# Altium project PROC054D_MMW_CAS_RF_EVM.PrjPcb (part 3 of 9)

## Sheet PROC054D_FMCW_Sync.SchDoc: FMCW_SYNC
size 558 x 431 mm; Date: Not shown in title block; ApprovedBy: Not shown in title block; CheckedBy: Not shown in title block; Author: Not shown in title block; CompanyName: Not shown in title block; DrawnBy: a0271760; Engineer: Not shown in title block; Organization: Not shown in title block; Address1: Not shown in title block; Address2: Not shown in title block; Address3: Not shown in title block; Address4: Not shown in title block; DocumentNumber: 14; Revision: Use project pAWRameter SCH_Rev; SheetNumber: 14; SheetTotal: 19; PageSetup: Record=PageOptions|CenterHorizontal=True|CenterVertical=True|PrintScale=1.00|XCorrection=1.00|YCorrection=1.00|PrintKind=0|BorderSize=5000000|LeftOffset=0|BottomOffset=0|Orientation=2|PaperLength=1000|PaperWidth=1000|Scale=100|PaperSource=15|PrintQuality=600|MediaType=1|DitherType=10|PaperKind=Letter|PrintScaleMode=1; CurrentTime: Not shown in title block; CurrentDate: Not shown in title block; Time: Not shown in title block; DocumentFullPathAndName: Not shown in title block; DocumentName: Not shown in title block; ModifiedDate: Not shown in title block; ImagePath: Not shown in title block
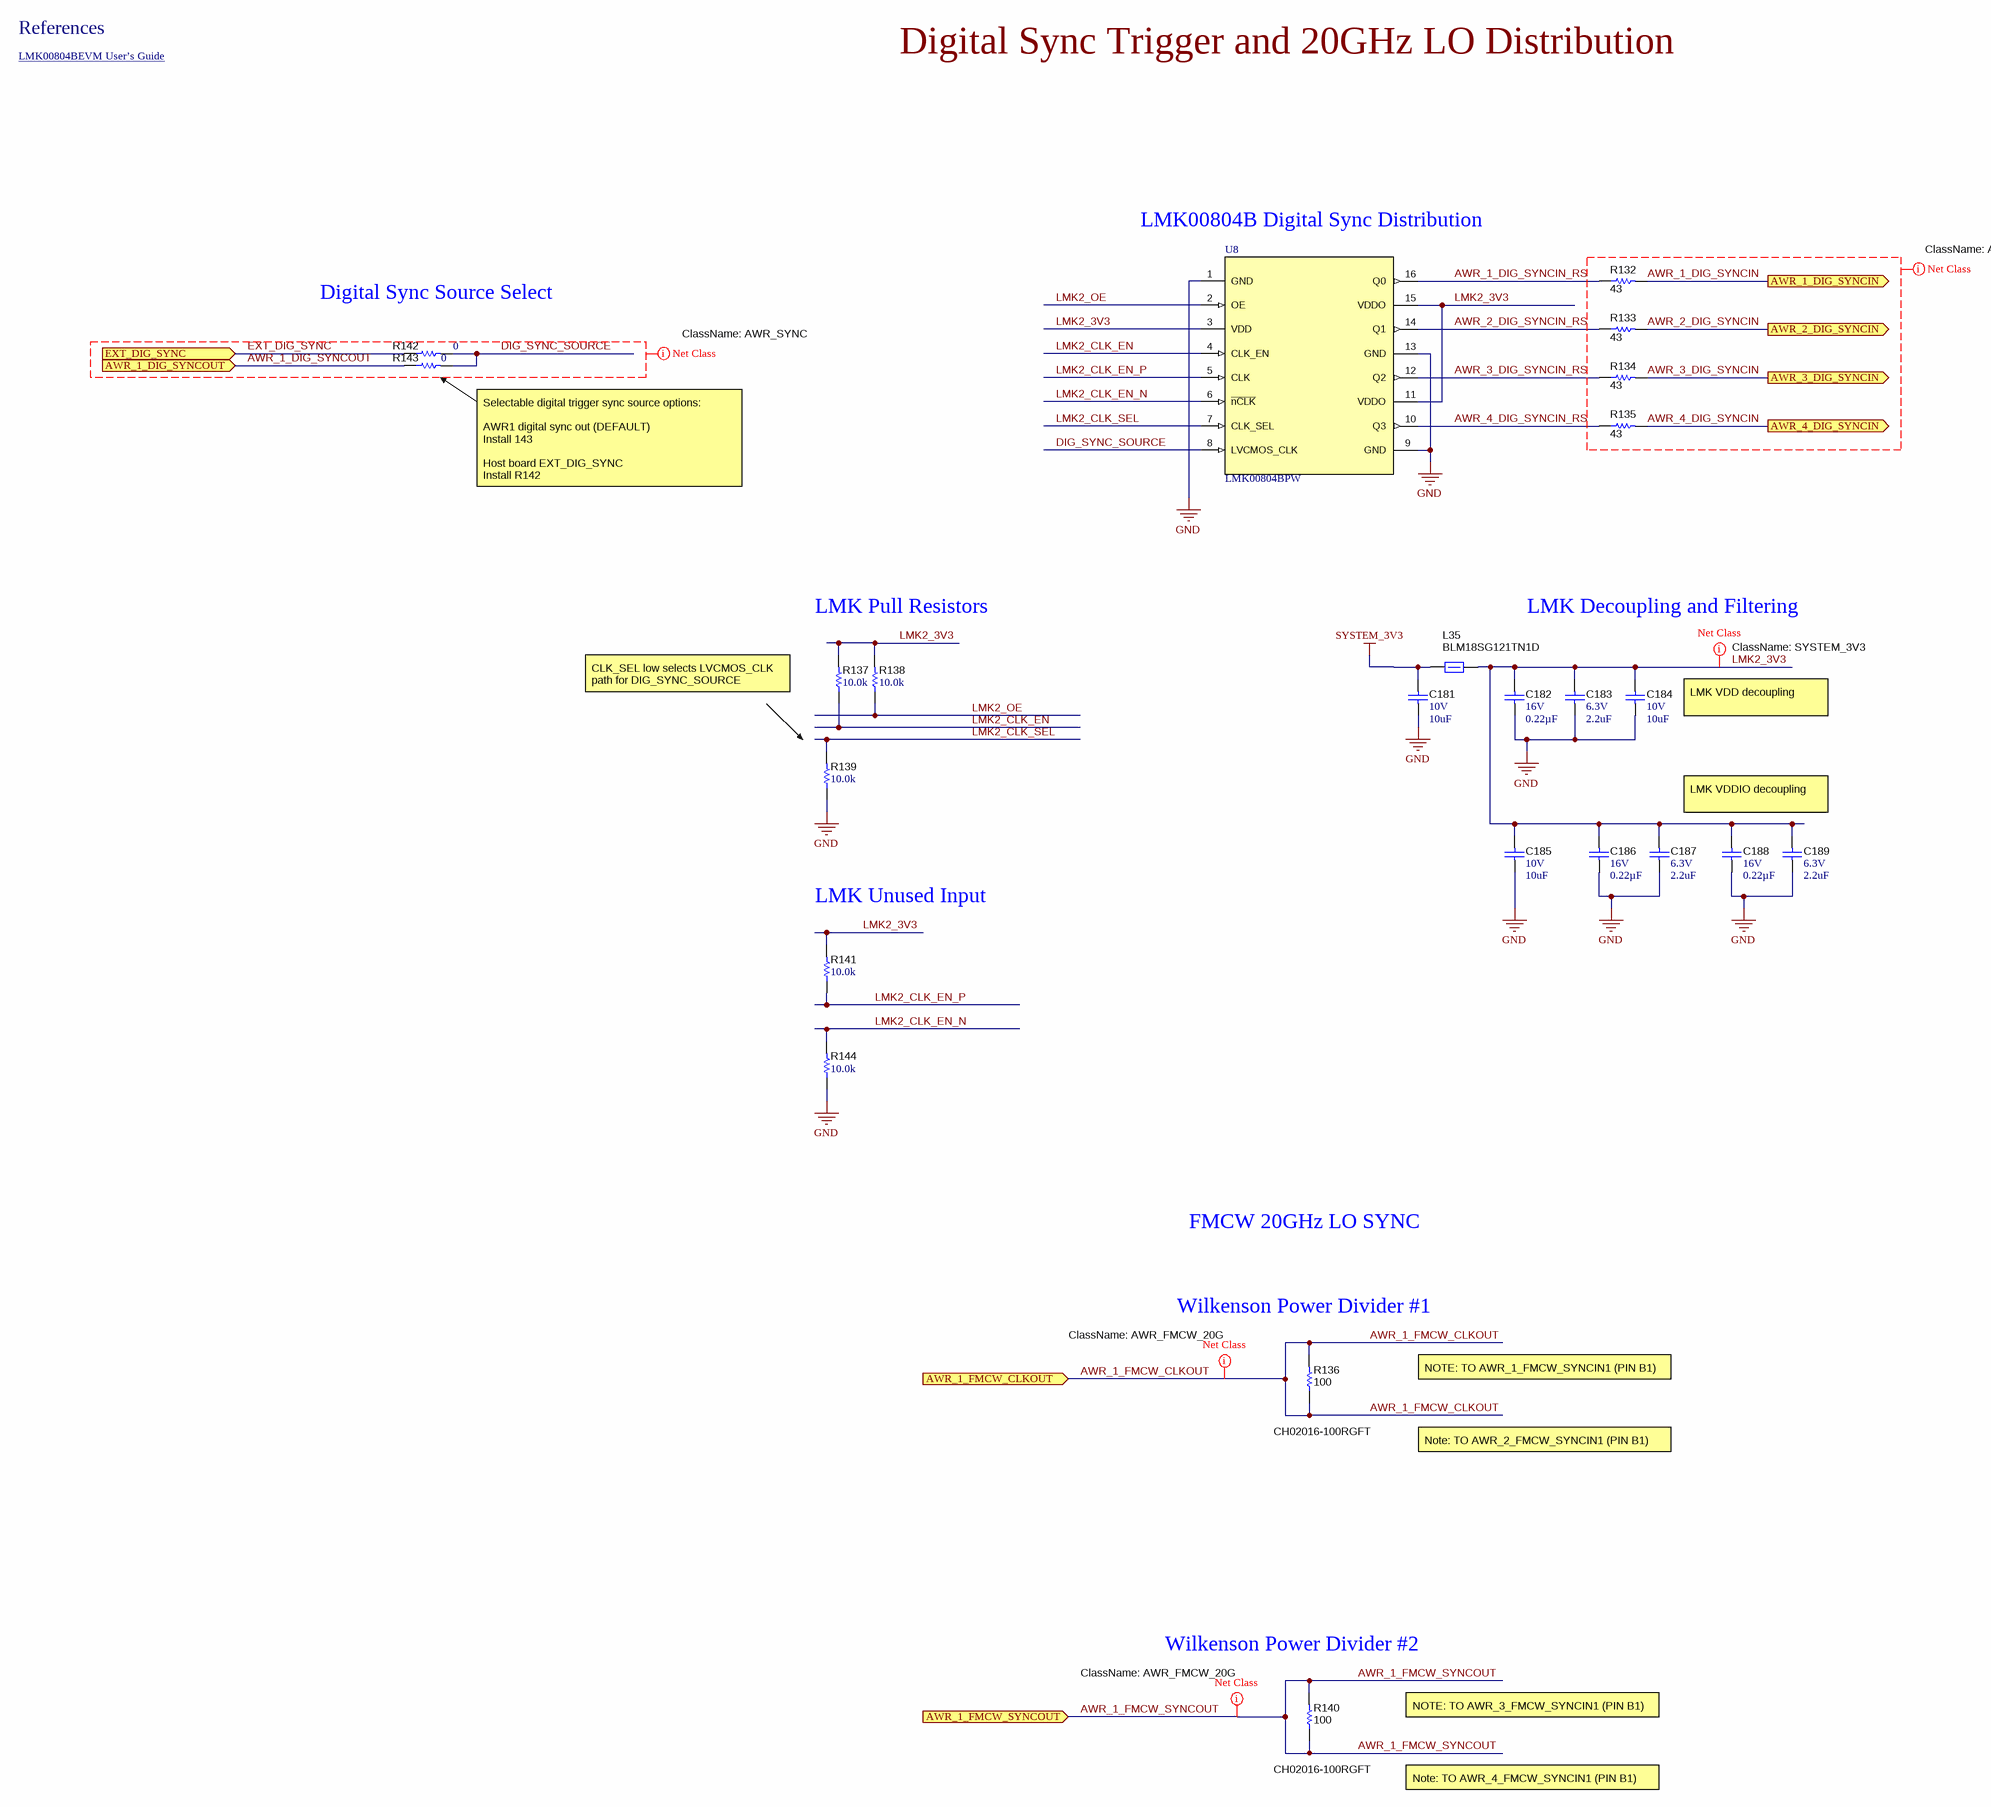
[diagram p10: PROC054D_FMCW_Sync.SchDoc]

### Parts
C181  VDC_V: 10V  ValueDisplayed: 10uF  [0805_HV]  (hidden comment: GCM21BR71A106KE22L)
C182  VDC_V: 16V  ValueDisplayed: 0.22µF  [0402]  (hidden comment: GCM155R71C224KE02D)
C183  VDC_V: 6.3V  ValueDisplayed: 2.2uF  [0603]  (hidden comment: GCM188R70J225KE22D)
C184  VDC_V: 10V  ValueDisplayed: 10uF  [0805_HV]  (hidden comment: GCM21BR71A106KE22L)
C185  VDC_V: 10V  ValueDisplayed: 10uF  [0805_HV]  (hidden comment: GCM21BR71A106KE22L)
C186  VDC_V: 16V  ValueDisplayed: 0.22µF  [0402]  (hidden comment: GCM155R71C224KE02D)
C187  VDC_V: 6.3V  ValueDisplayed: 2.2uF  [0603]  (hidden comment: GCM188R70J225KE22D)
C188  VDC_V: 16V  ValueDisplayed: 0.22µF  [0402]  (hidden comment: GCM155R71C224KE02D)
C189  VDC_V: 6.3V  ValueDisplayed: 2.2uF  [0603]  (hidden comment: GCM188R70J225KE22D)
L35  BLM18SG121TN1D  [0603]
R132  ValueDisplayed: 43  [0402]  (hidden comment: CRCW040243R0JNED)
R133  ValueDisplayed: 43  [0402]  (hidden comment: CRCW040243R0JNED)
R134  ValueDisplayed: 43  [0402]  (hidden comment: CRCW040243R0JNED)
R135  ValueDisplayed: 43  [0402]  (hidden comment: CRCW040243R0JNED)
R136  ValueDisplayed: 100  [02016]  (hidden comment: CH02016-100RGFT)
R137  ValueDisplayed: 10.0k  [0402]  (hidden comment: CRCW040210K0FKED)
R138  ValueDisplayed: 10.0k  [0402]  (hidden comment: CRCW040210K0FKED)
R139  ValueDisplayed: 10.0k  [0402]  (hidden comment: CRCW040210K0FKED)
R140  ValueDisplayed: 100  [02016]  (hidden comment: CH02016-100RGFT)
R141  ValueDisplayed: 10.0k  [0402]  (hidden comment: CRCW040210K0FKED)
R142  ValueDisplayed: 0  [0402]  (hidden comment: ERJ-2GE0R00X)
R143  ValueDisplayed: 0  [0402]  (hidden comment: ERJ-2GE0R00X)
R144  ValueDisplayed: 10.0k  [0402]  (hidden comment: CRCW040210K0FKED)
U8  LMK00804BPW  [PW0016A_N]

### Ports
AWR_1_DIG_SYNCIN (out), AWR_1_DIG_SYNCOUT (in), AWR_1_FMCW_CLKOUT (in), AWR_1_FMCW_SYNCOUT (in), AWR_2_DIG_SYNCIN (out), AWR_3_DIG_SYNCIN (out), AWR_4_DIG_SYNCIN (out), EXT_DIG_SYNC (in)

### Nets
GND: C181.2 C182.2 C183.1 C184.2 C185.2 C186.2 C187.1 C188.2 C189.1 R139.1 R144.1 U8.1(GND) U8.9(GND) U8.13(GND)
SYSTEM_3V3: C181.1 L35.1
AWR_1_DIG_SYNCIN: R132.2 ; port AWR_1_DIG_SYNCIN
AWR_1_DIG_SYNCIN_RS: R132.1 U8.16(Q0)
AWR_1_DIG_SYNCOUT: R143.1 ; port AWR_1_DIG_SYNCOUT
AWR_1_FMCW_CLKOUT: R136.1 R136.2 ; port AWR_1_FMCW_CLKOUT
AWR_1_FMCW_SYNCOUT: R140.1 R140.2 ; port AWR_1_FMCW_SYNCOUT
AWR_2_DIG_SYNCIN: R133.2 ; port AWR_2_DIG_SYNCIN
AWR_2_DIG_SYNCIN_RS: R133.1 U8.14(Q1)
AWR_3_DIG_SYNCIN: R134.2 ; port AWR_3_DIG_SYNCIN
AWR_3_DIG_SYNCIN_RS: R134.1 U8.12(Q2)
AWR_4_DIG_SYNCIN: R135.2 ; port AWR_4_DIG_SYNCIN
AWR_4_DIG_SYNCIN_RS: R135.1 U8.10(Q3)
DIG_SYNC_SOURCE: R142.2 R143.2 U8.8(LVCMOS_CLK)
EXT_DIG_SYNC: R142.1 ; port EXT_DIG_SYNC
LMK2_3V3: C182.1 C183.2 C184.1 C185.1 C186.1 C187.2 C188.1 C189.2 L35.2 R137.2 R138.2 R141.2 U8.3(VDD) U8.11(VDDO) U8.15(VDDO)
LMK2_CLK_EN: R137.1 U8.4(CLK_EN)
LMK2_CLK_EN_N: R144.2 U8.6(~{nCLK})
LMK2_CLK_EN_P: R141.1 U8.5(CLK)
LMK2_CLK_SEL: R139.2 U8.7(CLK_SEL)
LMK2_OE: R138.1 U8.2(OE)

### Layout directives
net class SYSTEM_3V3: LMK2_3V3
net class AWR_FMCW_20G: AWR_1_FMCW_CLKOUT, AWR_1_FMCW_SYNCOUT
net class AWR_SYNC: AWR_1_DIG_SYNCIN, AWR_1_DIG_SYNCOUT, AWR_2_DIG_SYNCIN, AWR_3_DIG_SYNCIN, AWR_4_DIG_SYNCIN, DIG_SYNC_SOURCE, EXT_DIG_SYNC

### Notes on the sheet
- References
- LMK00804BEVM User’s Guide <http://www.ti.com/lit/ug/snou129/snou129.pdf>
- Digital Sync Trigger and 20GHz LO Distribution
- LMK00804B Digital Sync Distribution
- Digital Sync Source Select
- Selectable digital trigger sync source options:
  AWR1 digital sync out (DEFAULT)
  Install 143
  Host board EXT_DIG_SYNC
  Install R142
- LMK Pull Resistors
- LMK Decoupling and Filtering
- CLK_SEL low selects LVCMOS_CLK path for DIG_SYNC_SOURCE
- LMK VDD decoupling
- LMK VDDIO decoupling
- LMK Unused Input
- FMCW 20GHz LO SYNC
- Wilkenson Power Divider #1
- NOTE: TO AWR_1_FMCW_SYNCIN1 (PIN B1)
- Note: TO AWR_2_FMCW_SYNCIN1 (PIN B1)
- Wilkenson Power Divider #2
- NOTE: TO AWR_3_FMCW_SYNCIN1 (PIN B1)
- Note: TO AWR_4_FMCW_SYNCIN1 (PIN B1)
- Drawn By:
- SVN Rev:
- Number:
- TID #:
- Orderable:
- Rev:
- Sheet Title:
- File:
- Project Title:
- Designed for:
- Assembly VAWRiant:
- Mod. Date:
- Sheet:
- Size:
- of
- C
- http://www.ti.com
- Texas Instruments and/or its licensors do not wAWRrant the accuracy or completeness of this specification or any information contained therein. Texas Instruments and/or its licensors do not wAWRrant that this design will meet the specifications, will be suitable for your application or fit for any pAWRticulAWR purpose, or will operate in an implementation. Texas Instruments and/or its licensors do not wAWRrant that the design is production worthy. You should completely validate and test your design implementation to confirm the system functionality for your application.
- Engineer:
- Contact:
- © Texas Instruments

### Library data of the parts
C181 C184 C185 = CMP-0008017-2: CAP, CERM, 10 uF, 10 V, +/- 10%, X7R, 0805; Manufacturer: MuRata; TaMin_C: -55°C; Polarized: N; SizeAreaWB_mm2: 6.75; Value1: Unknown; U/M: EA; Value: 10uF; TaMax_C: 125°C; SizeZ_mm: 1.45; SizeX_mm: 2; SizeY_mm: 1.25; Cap_Case: 0805; SizeArea_mm2: 2.5; CompType: Capacitor; Cap_F: 10µF; AEC Category: Q200; Supplier Part Number 2: 06AC6014; Publisher: Texas Instruments; Supplier 2: Newark; Supplier Part Number 3: 81-GCM21BR71A106KE2L; TempCo: X7R; Supplier 3: Mouser; Published: 2008-06-19; RoHS: Y; MountType: SMT; Supplier 1: Digi-Key; PackageReference: 0805; Tolerance_%: 10%; Value2: 10V; LatestRevisionDate: 2017-03-09; PartNumber: GCM21BR71A106KE22L; AEC Qualified: ?; ComponentLink1Description: Datasheet link; Supplier Part Number 1: 490-10674-1-ND; Technology: Ceramic; ComponentLink1URL: http://www.murata.com/products/catalog/pdf/c03e.pdf
C182 C186 C188 = CMP-0078265-1: CAP, CERM, 0.22 µF, 16 V,+/- 10%, X7R, AEC-Q200 Grade 1, 0402; Manufacturer: MuRata; TaMin_C: -55°C; Polarized: N; SizeAreaWB_mm2: 3; U/M: EA; Value: 0.22uF; TaMax_C: 125°C; SizeZ_mm: 0.6; SizeX_mm: 1; SizeY_mm: 0.5; CompType: Capacitor; AEC Qualified: Y; Cap_F: 220nF; AEC Category: Q200; ComponentLink1URL: http://psearch.en.murata.com/capacitor/product/GCM155R71C224KE02%23.pdf; Supplier Part Number 2: 81-GCM155R71C224KE2D; Supplier 2: Mouser; TempCo: X7R; RoHS: Y; MountType: SMT; Supplier 1: Digi-Key; PackageReference: 0402; Tolerance_%: 10%; Cap_Case: 0402; Value2: 16V; SizeArea_mm2: 0.5; PartNumber: GCM155R71C224KE02D; ComponentLink1Description: Datasheet link; AEC Grade: 1; Supplier Part Number 1: 490-10671-1-ND; Technology: Ceramic
C183 C187 C189 = CMP-0007134-5: CAP, CERM, 2.2 uF, 6.3 V, +/- 10%, X7R, AEC-Q200 Grade 1, 0603; Manufacturer: MuRata; TaMin_C: -55°C; Polarized: N; SizeAreaWB_mm2: 4.68; Value1: Unknown; U/M: EA; Value: 2.2uF; TaMax_C: 125°C; SizeZ_mm: 1; SizeX_mm: 1.6; SizeY_mm: 0.8; SizeArea_mm2: 1.28; AEC Qualified: Y; Cap_F: 2.2µF; AEC Category: Q200; Supplier Part Number 2: 81-GCM188R70J225KE2D; Publisher: Texas Instruments; Supplier 2: Mouser; TempCo: X7R; Published: 2008-06-19; RoHS: Y; MountType: SMT; Supplier 1: Digi-Key; PackageReference: 0603; Tolerance_%: 10%; Cap_Case: 0603; Value2: 6.3V; CompType: Capacitor; LatestRevisionDate: 2017-03-09; PartNumber: GCM188R70J225KE22D; ComponentLink1Description: Datasheet link; AEC Grade: 1; Supplier Part Number 1: 490-5316-1-ND; Technology: Ceramic; ComponentLink1URL: http://psearch.en.murata.com/capacitor/product/GCM188R70J225KE22%23.pdf
L35 = CMP-0003352-2: Ferrite Bead, 120 ohm @ 100 MHz, 3 A, 0603; Manufacturer: MuRata; ZTyp@100MHz_Ohm: 120; SizeAreaWB_mm2: 4.68; DCR_ohm: 0.025; Value1: 0.025 ohm; Value: 120 ohm; Imax_A: 3A; SizeZ_mm: 1; SizeX_mm: 1.6; SizeY_mm: 0.8; SizeArea_mm2: 1.28; ComponentLink1URL: http://search.murata.co.jp/Ceramy/image/img/PDF/ENG/L0110S0100BLM18S.pdf; Supplier Part Number 2: 73M9122; Publisher: Texas Instruments; Supplier 2: Newark; Supplier Part Number 3: 81-BLM18SG121TN1D; Supplier 3: Mouser; Published: 2014-04-30; RoHS: Y; MountType: SMT; Supplier 1: Digi-Key; PackageReference: 0603; Value2: 3A; CompType: Ferrite Bead; LatestRevisionDate: 2017-03-09; PartNumber: BLM18SG121TN1D; ComponentLink1Description: Datasheet link; Supplier Part Number 1: 490-3996-1-ND; ValueDisplayed: 120 ohm
R132-R135 = CMP-0026932-3: RES, 43, 5%, 0.063 W, AEC-Q200 Grade 0, 0402; Manufacturer: Vishay-Dale; Power_W: 63mW; TempCo: 200 ppm/C; Value_Code: 43R0; Value: 43; EIA_Code: E24; SizeX_mm: 1; SizeY_mm: 0.5; SizeZ_mm: 0.6; Value2: 0.063W; AEC Qualified: Y; VDC_V: 50V; AEC Category: Q200; AEC Grade: 0; Supplier Part Number 2: 71-CRCW0402J-43-E3; Supplier 2: Mouser; RoHS: E; Value1: 5%; MountType: SMT; Supplier 1: Digi-Key; PackageReference: 0402; Tolerance_%: 5%; Res_ohm: 43; SizeArea_mm2: 0.5; CompType: Resistor; PartNumber: CRCW040243R0JNED; ComponentLink1Description: Datasheet link; Supplier Part Number 1: 541-43JCT-ND; Technology: Thick Film; ComponentLink1URL: http://www.vishay.com/docs/20035/dcrcwe3.pdf
R136 = CMP-0083872-1: RES, 100, 2%, 0.03 W, 02016; Manufacturer: Vishay-Semiconductor; Tolerance_%: 5%; Value_Code: 100R; SizeAreaWB_mm2: 2.0572; SizeArea_mm2: 0.1872; AEC Qualified: N; AEC Category: Q200; Value: 100; SizeZ_mm: 0.547; EIA_Code: E24; TempCo: 100 ppm/C; Power_W: 30mW; VDC_V: 30V; SizeY_mm: 0.39; Value2: 0.03W; SizeX_mm: 0.48; ComponentLink1Description: Datasheet link; RoHS: Y; PackageReference: 02016; Technology: Thin Film; Res_ohm: 100; PartNumber: CH02016-100RGFT; AEC Grade: N/A; ComponentLink1URL: http://www.vishay.com/docs/53014/ch.pdf; Value1: 2%; CompType: Resistor; MountType: SMT
R137-R139 R141 R144 = CMP-0025958-3: RES, 10.0 k, 1%, 0.063 W, AEC-Q200 Grade 0, 0402; Manufacturer: Vishay-Dale; Power_W: 63mW; TempCo: 100 ppm/C; Value_Code: 10k0; Value: 10.0k; EIA_Code: E96; Res_ohm: 10k; SizeX_mm: 1; SizeY_mm: 0.5; SizeZ_mm: 0.6; Value2: 0.063W; AEC Qualified: Y; VDC_V: 50V; AEC Category: Q200; AEC Grade: 0; Supplier Part Number 2: 52K6595; Supplier 2: Newark; Supplier Part Number 3: 71-CRCW0402-10K-E3; Supplier 3: Mouser; RoHS: E; Value1: 1%; MountType: SMT; Supplier 1: Digi-Key; PackageReference: 0402; Tolerance_%: 1%; SizeArea_mm2: 0.5; CompType: Resistor; PartNumber: CRCW040210K0FKED; ComponentLink1Description: Datasheet link; Supplier Part Number 1: 541-10.0KLCT-ND; Technology: Thick Film; ComponentLink1URL: http://www.vishay.com/docs/20035/dcrcwe3.pdf
R140 = CMP-0083872-1: RES, 100, 2%, 0.03 W, 02016; Manufacturer: Vishay-Semiconductor; Value_Code: 100R; SizeAreaWB_mm2: 2.0572; SizeArea_mm2: 0.1872; AEC Qualified: N; AEC Category: Q200; Value: 100; SizeZ_mm: 0.547; EIA_Code: E24; TempCo: 100 ppm/C; Power_W: 30mW; VDC_V: 30V; SizeY_mm: 0.39; Value2: 0.03W; Value1: 5%; SizeX_mm: 0.48; ComponentLink1Description: Datasheet link; RoHS: Y; Tolerance_%: 2%; PackageReference: 02016; Technology: Thin Film; Res_ohm: 100; PartNumber: CH02016-100RGFT; AEC Grade: N/A; ComponentLink1URL: http://www.vishay.com/docs/53014/ch.pdf; CompType: Resistor; MountType: SMT
R142 = CMP-0026992-3: RES, 0, 5%, 0.1 W, AEC-Q200 Grade 0, 0402; Manufacturer: Panasonic; Power_W: 100mW; TempCo: 600 ppm/C; Value_Code: 0000; Value: 0; EIA_Code: E24; SizeX_mm: 1; SizeY_mm: 0.5; SizeZ_mm: 0.6; Value2: 0.1W; CompType: Resistor; AEC Qualified: Y; VDC_V: 50V; AEC Category: Q200; SizeAreaWB_mm2: 3; Supplier Part Number 2: 65T8307; Supplier 2: Newark; Supplier Part Number 3: 667-ERJ-2GE0R00X; Supplier 3: Mouser; RoHS: Y; Value1: 5%; MountType: SMT; Supplier 1: Digi-Key; PackageReference: 0402; Tolerance_%: 5%; Res_ohm: 0; SizeArea_mm2: 0.5; PartNumber: ERJ-2GE0R00X; ComponentLink1Description: Datasheet link; Supplier Part Number 1: P0.0JCT-ND; Technology: Thick Film; ComponentLink1URL: https://industrial.panasonic.com/cdbs/www-data/pdf/RDA0000/AOA0000C301.pdf; AEC Grade: 0
R143 = CMP-0026992-3: RES, 0, 5%, 0.1 W, AEC-Q200 Grade 0, 0402; Manufacturer: Panasonic; Power_W: 100mW; TempCo: 600 ppm/C; Value_Code: 0000; Value: 0; EIA_Code: E24; SizeX_mm: 1; SizeY_mm: 0.5; SizeZ_mm: 0.6; Value2: 0.1W; AEC Qualified: Y; VDC_V: 50V; AEC Category: Q200; SizeAreaWB_mm2: 3; Supplier Part Number 2: 65T8307; Supplier 2: Newark; Supplier Part Number 3: 667-ERJ-2GE0R00X; Supplier 3: Mouser; RoHS: Y; Value1: 5%; MountType: SMT; Supplier 1: Digi-Key; PackageReference: 0402; Tolerance_%: 5%; Res_ohm: 0; SizeArea_mm2: 0.5; CompType: Resistor; PartNumber: ERJ-2GE0R00X; ComponentLink1Description: Datasheet link; Supplier Part Number 1: P0.0JCT-ND; Technology: Thick Film; ComponentLink1URL: https://industrial.panasonic.com/cdbs/www-data/pdf/RDA0000/AOA0000C301.pdf; AEC Grade: 0
U8 = CMP-0065663-1: Low Skew, 1-to-4 Multiplexed Differential/LVCMOS-to-LVCMOS/TTL Fanout Buffer, PW0016A (TSSOP-16); Alternate Manufacturer: Texas Instruments; Green_Lifecycle: Active; SizeAreaWB_mm2: 58.8; Green_REACh: Passed; U/M: EA; SizeZ_mm: 1.2; SizeX_mm: 6.4; SizeY_mm: 5.0; SizeArea_mm2: 32.0; CompType: IC; ComponentLink1URL: http://www.ti.com/lit/ds/symlink/lmk00804b.pdf; Publisher: Texas Instruments; PackageDescription: TSSOP-16; RoHS: Y; Footprint Path 6: C:\AltiumLibraries\Footprints\TI\.PcbLib; MountType: SMT; Green_EU RoHS-2: Passed; Manufacturer: Texas Instruments; Green_EU RoHS: Passed; PackageReference: PW0016A; LatestRevisionDate: 2017-06-09; PartNumber: LMK00804BPW; ComponentLink1Description: Datasheet Link

## Sheet PROC054D_SMA_SMP_Connectors.SchDoc: SMA_SMP_CONNECTORS
size 558 x 431 mm; Date: Not shown in title block; ApprovedBy: Not shown in title block; CheckedBy: Not shown in title block; Author: Not shown in title block; CompanyName: Not shown in title block; DrawnBy: a0271760; Engineer: Not shown in title block; Organization: Not shown in title block; Address1: Not shown in title block; Address2: Not shown in title block; Address3: Not shown in title block; Address4: Not shown in title block; DocumentNumber: 15; Revision: Use project pAWRameter SCH_Rev; SheetNumber: 15; SheetTotal: 19; PageSetup: Record=PageOptions|CenterHorizontal=True|CenterVertical=True|PrintScale=1.00|XCorrection=1.00|YCorrection=1.00|PrintKind=0|BorderSize=5000000|LeftOffset=0|BottomOffset=0|Orientation=2|PaperLength=1000|PaperWidth=1000|Scale=100|PaperSource=15|PrintQuality=600|MediaType=1|DitherType=10|PaperKind=Letter|PrintScaleMode=1; CurrentTime: Not shown in title block; CurrentDate: Not shown in title block; Time: Not shown in title block; DocumentFullPathAndName: Not shown in title block; DocumentName: Not shown in title block; ModifiedDate: Not shown in title block; ImagePath: Not shown in title block
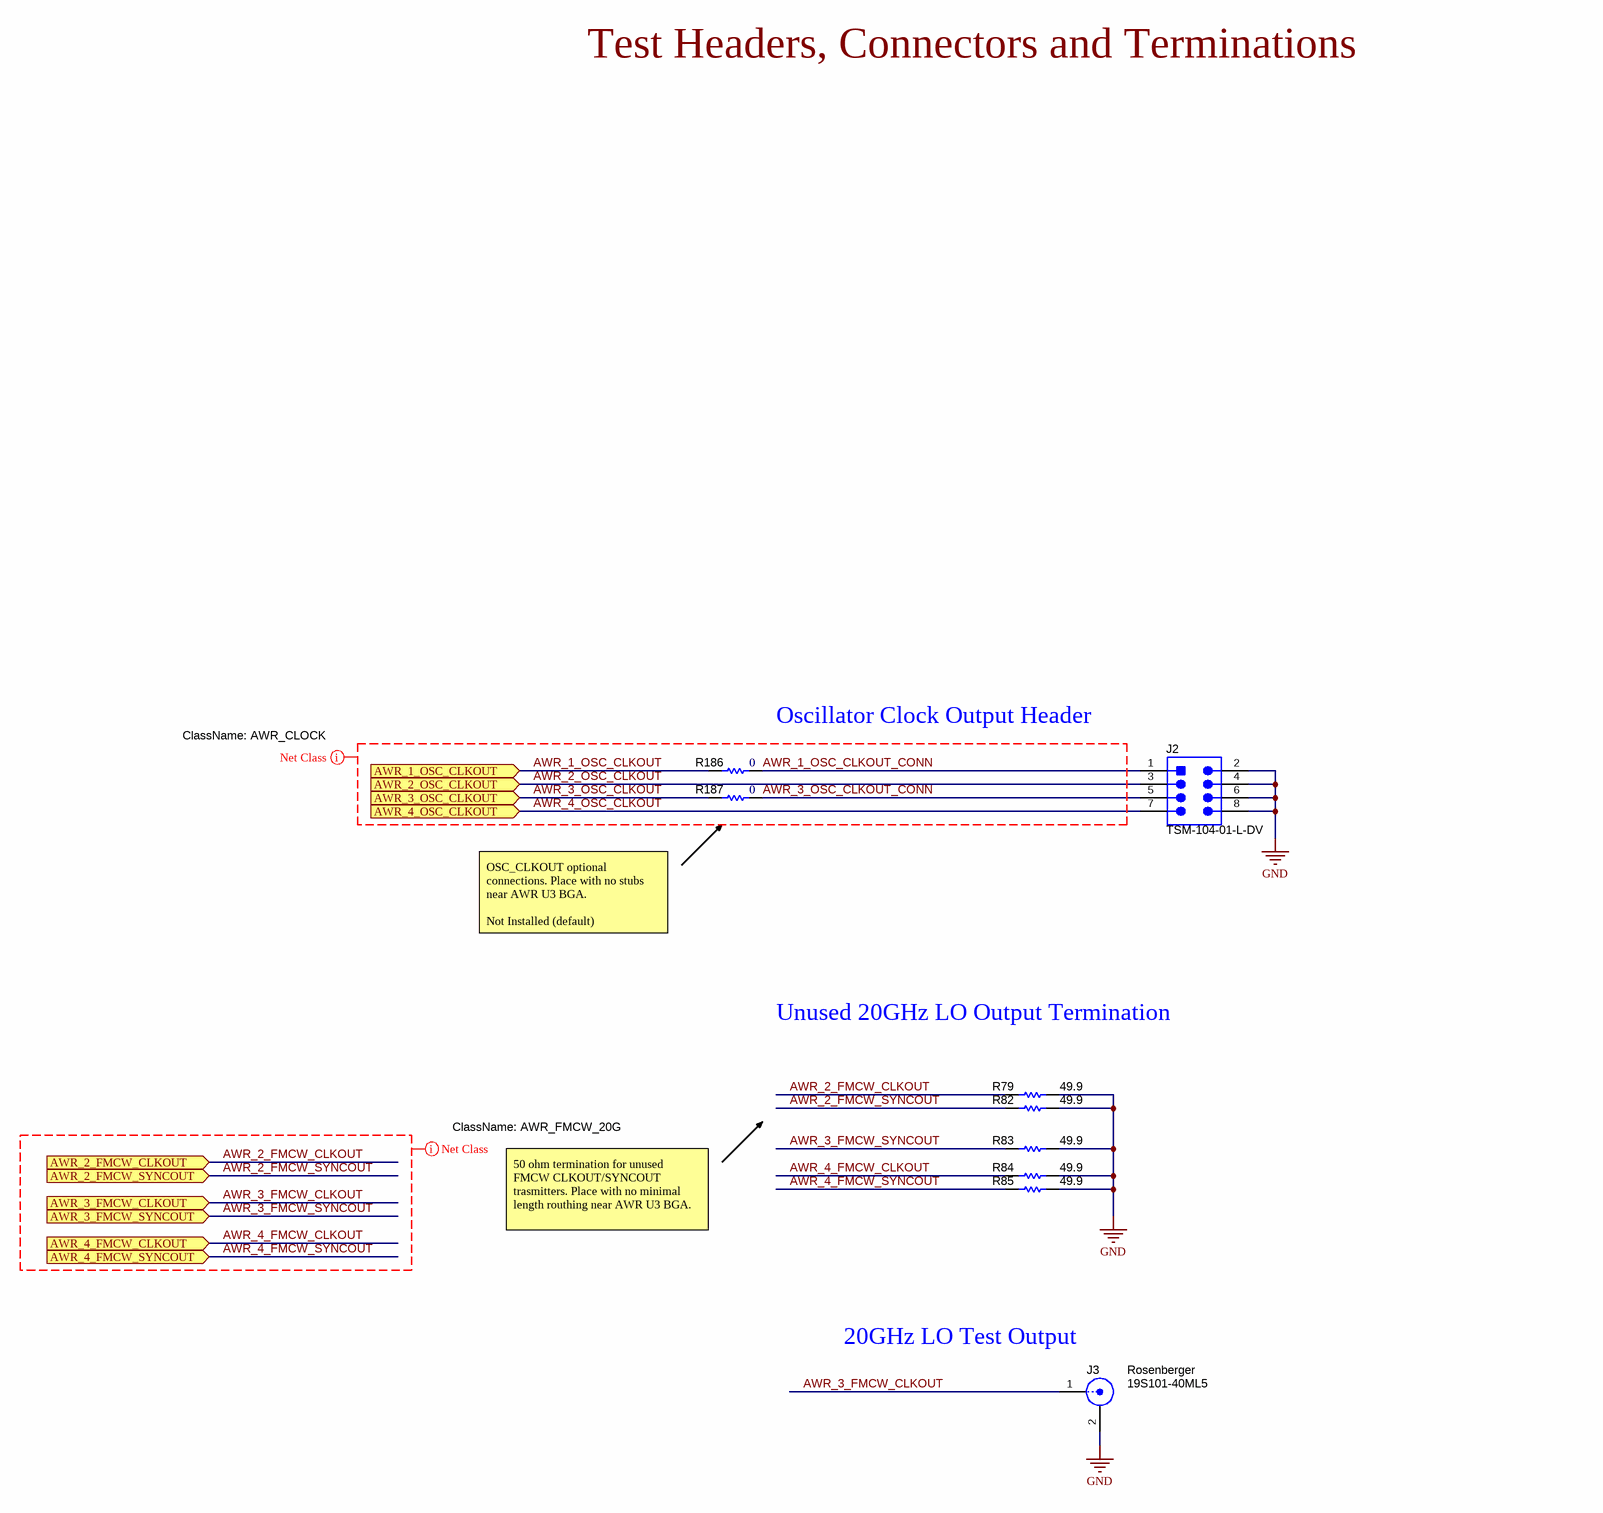
[diagram p11: PROC054D_SMA_SMP_Connectors.SchDoc]

### Parts
J2  TSM-104-01-L-DV  [Samtec_TSM-104-01-x-DV]
J3  19S101-40ML5  Manufacturer: Rosenberger  [19S101_40ML5]
R79  ValueDisplayed: 49.9  [0402]  (hidden comment: CRCW040249R9FKED)
R82  ValueDisplayed: 49.9  [0402]  (hidden comment: CRCW040249R9FKED)
R83  ValueDisplayed: 49.9  [0402]  (hidden comment: CRCW040249R9FKED)
R84  ValueDisplayed: 49.9  [0402]  (hidden comment: CRCW040249R9FKED)
R85  ValueDisplayed: 49.9  [0402]  (hidden comment: CRCW040249R9FKED)
R186  ValueDisplayed: 0  [0402S]  (hidden comment: ERJ-2GE0R00X)
R187  ValueDisplayed: 0  [0402S]  (hidden comment: ERJ-2GE0R00X)

### Ports
AWR_1_OSC_CLKOUT (in), AWR_2_FMCW_CLKOUT (in), AWR_2_FMCW_SYNCOUT (in), AWR_2_OSC_CLKOUT (in), AWR_3_FMCW_CLKOUT (in), AWR_3_FMCW_SYNCOUT (in), AWR_3_OSC_CLKOUT (in), AWR_4_FMCW_CLKOUT (in), AWR_4_FMCW_SYNCOUT (in), AWR_4_OSC_CLKOUT (in)

### Nets
GND: J2.2 J2.4 J2.6 J2.8 J3.2 R79.2 R82.2 R83.2 R84.2 R85.2
AWR_1_OSC_CLKOUT: R186.1 ; port AWR_1_OSC_CLKOUT
AWR_1_OSC_CLKOUT_CONN: J2.1 R186.2
AWR_2_FMCW_CLKOUT: R79.1 ; port AWR_2_FMCW_CLKOUT
AWR_2_FMCW_SYNCOUT: R82.1 ; port AWR_2_FMCW_SYNCOUT
AWR_2_OSC_CLKOUT: J2.3 ; port AWR_2_OSC_CLKOUT
AWR_3_FMCW_CLKOUT: J3.1 ; port AWR_3_FMCW_CLKOUT
AWR_3_FMCW_SYNCOUT: R83.1 ; port AWR_3_FMCW_SYNCOUT
AWR_3_OSC_CLKOUT: R187.1 ; port AWR_3_OSC_CLKOUT
AWR_3_OSC_CLKOUT_CONN: J2.5 R187.2
AWR_4_FMCW_CLKOUT: R84.1 ; port AWR_4_FMCW_CLKOUT
AWR_4_FMCW_SYNCOUT: R85.1 ; port AWR_4_FMCW_SYNCOUT
AWR_4_OSC_CLKOUT: J2.7 ; port AWR_4_OSC_CLKOUT

### Layout directives
net class AWR_FMCW_20G: AWR_2_FMCW_CLKOUT, AWR_2_FMCW_SYNCOUT, AWR_3_FMCW_CLKOUT, AWR_3_FMCW_SYNCOUT, AWR_4_FMCW_CLKOUT, AWR_4_FMCW_SYNCOUT
net class AWR_CLOCK: AWR_1_OSC_CLKOUT, AWR_1_OSC_CLKOUT_CONN, AWR_2_OSC_CLKOUT, AWR_3_OSC_CLKOUT, AWR_3_OSC_CLKOUT_CONN, AWR_4_OSC_CLKOUT

### Notes on the sheet
- Test Headers, Connectors and Terminations
- Oscillator Clock Output Header
- OSC_CLKOUT optional connections. Place with no stubs near AWR U3 BGA.
  Not Installed (default)
- Unused 20GHz LO Output Termination
- 50 ohm termination for unused FMCW CLKOUT/SYNCOUT trasmitters. Place with no minimal length routhing near AWR U3 BGA.
- (near J3) 20GHz LO Test Output
- Drawn By:
- SVN Rev:
- Number:
- TID #:
- Orderable:
- Rev:
- Sheet Title:
- File:
- Project Title:
- Designed for:
- Assembly VAWRiant:
- Mod. Date:
- Sheet:
- Size:
- of
- C
- http://www.ti.com
- Texas Instruments and/or its licensors do not wAWRrant the accuracy or completeness of this specification or any information contained therein. Texas Instruments and/or its licensors do not wAWRrant that this design will meet the specifications, will be suitable for your application or fit for any pAWRticulAWR purpose, or will operate in an implementation. Texas Instruments and/or its licensors do not wAWRrant that the design is production worthy. You should completely validate and test your design implementation to confirm the system functionality for your application.
- Engineer:
- Contact:
- © Texas Instruments

### Library data of the parts
J2 = CMP-0075593-2: Header, 2.54mm, 4x2, Gold, SMT; Manufacturer: Samtec; Pitch_mm: 2.54; Gender: Male; Cert_CSA: Y; Green_REACh: Passed; Current_A: 4.9A; Voltage_V: 475V; Shrouded: N; Green_Lifecycle: Active; Row_Count: 2; ComponentLink1Description: Datasheet URL; RoHS: Y; Supplier Part Number 3: 1803506; Supplier 1: Digi-Key; Cert_UL: Y; Orientation: Vertical; Green_EU RoHS: Passed; PackageReference: Header, 2.54mm, 4x2, SMT; Color: Black; PartNumber: TSM-104-01-L-DV; PinCount: 8; Supplier Part Number 2: 77P5924; ContactFinish: Gold; Supplier 2: Newark; ClassName: Header; RowSpacing_mm: 2.54; ComponentLink1URL: https://www.samtec.com/ftppub/cpdf/TSM-1XX-XX-XXX-XX-X-XXX-X-MKT.pdf; CompType: Header; MountType: SMT; Supplier Part Number 1: TSM-104-01-L-DV-ND; Supplier 3: Farnell; Green_EU RoHS-2: Passed
J3 = CMP-0055458-1: Connector, RF 50 Ohms, SMT; CT: FALSE; ComponentLink1URL: https://sps06.itg.ti.com/sites/KMS/crossdivteams/altium/docs/ComponentDatasheets/hd19S101-40ML5_e[1].pdf; Publisher: Texas Instruments; CompType: Connector; PackageReference: 5.2x4.1x5.2 mm; LatestRevisionDate: 26/05/2017; RoHS: Y; CNHeader: FALSE; MountType: SMT; PartNumber: 19S101-40ML5; ComponentLink1Description: Datasheet URL
R79 R82-R85 = CMP-0026404-2: RES, 49.9, 1%, 0.063 W, AEC-Q200 Grade 0, 0402; Manufacturer: Vishay-Dale; Power_W: 63mW; TempCo: 100 ppm/C; Value_Code: 49R9; Value: 49.9; EIA_Code: E96; SizeX_mm: 1; SizeY_mm: 0.5; SizeZ_mm: 0.6; Value2: 0.063W; AEC Qualified: Y; VDC_V: 50V; AEC Category: Q200; AEC Grade: 0; ComponentLink1URL: http://www.vishay.com/docs/20035/dcrcwe3.pdf; Supplier Part Number 2: 52K7114; Supplier 2: Newark; Supplier Part Number 3: 71-CRCW0402-49.9-E3; Supplier 3: Mouser; RoHS: E; Value1: 1%; MountType: SMT; Supplier 1: Digi-Key; PackageReference: 0402; Tolerance_%: 1%; Res_ohm: 49.9; SizeArea_mm2: 0.5; CompType: Resistor; PartNumber: CRCW040249R9FKED; ComponentLink1Description: Datasheet link; Supplier Part Number 1: 541-49.9LCT-ND; Technology: Thick Film
R186 R187 = CMP-0026992-3: as R143 on sheet PROC054D_FMCW_Sync; Supplier Part Number 2: 65T8307; Supplier 2: Newark; Supplier Part Number 3: 667-ERJ-2GE0R00X; Supplier 3: Mouser; RoHS: Y; Value1: 5%; MountType: SMT; Supplier 1: Digi-Key; PackageReference: 0402; Tolerance_%: 5%; Res_ohm: 0; SizeArea_mm2: 0.5; CompType: Resistor; PartNumber: ERJ-2GE0R00X; ComponentLink1Description: Datasheet link; Supplier Part Number 1: P0.0JCT-ND; Technology: Thick Film; ComponentLink1URL: https://industrial.panasonic.com/cdbs/www-data/pdf/RDA0000/AOA0000C301.pdf; AEC Grade: 0

## Sheet PROC054D_Temp_Sensor.SchDoc: ON_BRD_TEMP_SENSOR
size 558 x 431 mm; Date: Not shown in title block; ApprovedBy: Not shown in title block; CheckedBy: Not shown in title block; Author: Not shown in title block; CompanyName: Not shown in title block; DrawnBy: a0271760; Engineer: Not shown in title block; Organization: Not shown in title block; Address1: Not shown in title block; Address2: Not shown in title block; Address3: Not shown in title block; Address4: Not shown in title block; DocumentNumber: 16; Revision: Use project pAWRameter SCH_Rev; SheetNumber: 16; SheetTotal: 19; PageSetup: Record=PageOptions|CenterHorizontal=True|CenterVertical=True|PrintScale=1.00|XCorrection=1.00|YCorrection=1.00|PrintKind=0|BorderSize=5000000|LeftOffset=0|BottomOffset=0|Orientation=2|PaperLength=1000|PaperWidth=1000|Scale=100|PaperSource=15|PrintQuality=600|MediaType=1|DitherType=10|PaperKind=Letter|PrintScaleMode=1; CurrentTime: Not shown in title block; CurrentDate: Not shown in title block; Time: Not shown in title block; DocumentFullPathAndName: Not shown in title block; DocumentName: Not shown in title block; ModifiedDate: Not shown in title block; ImagePath: Not shown in title block
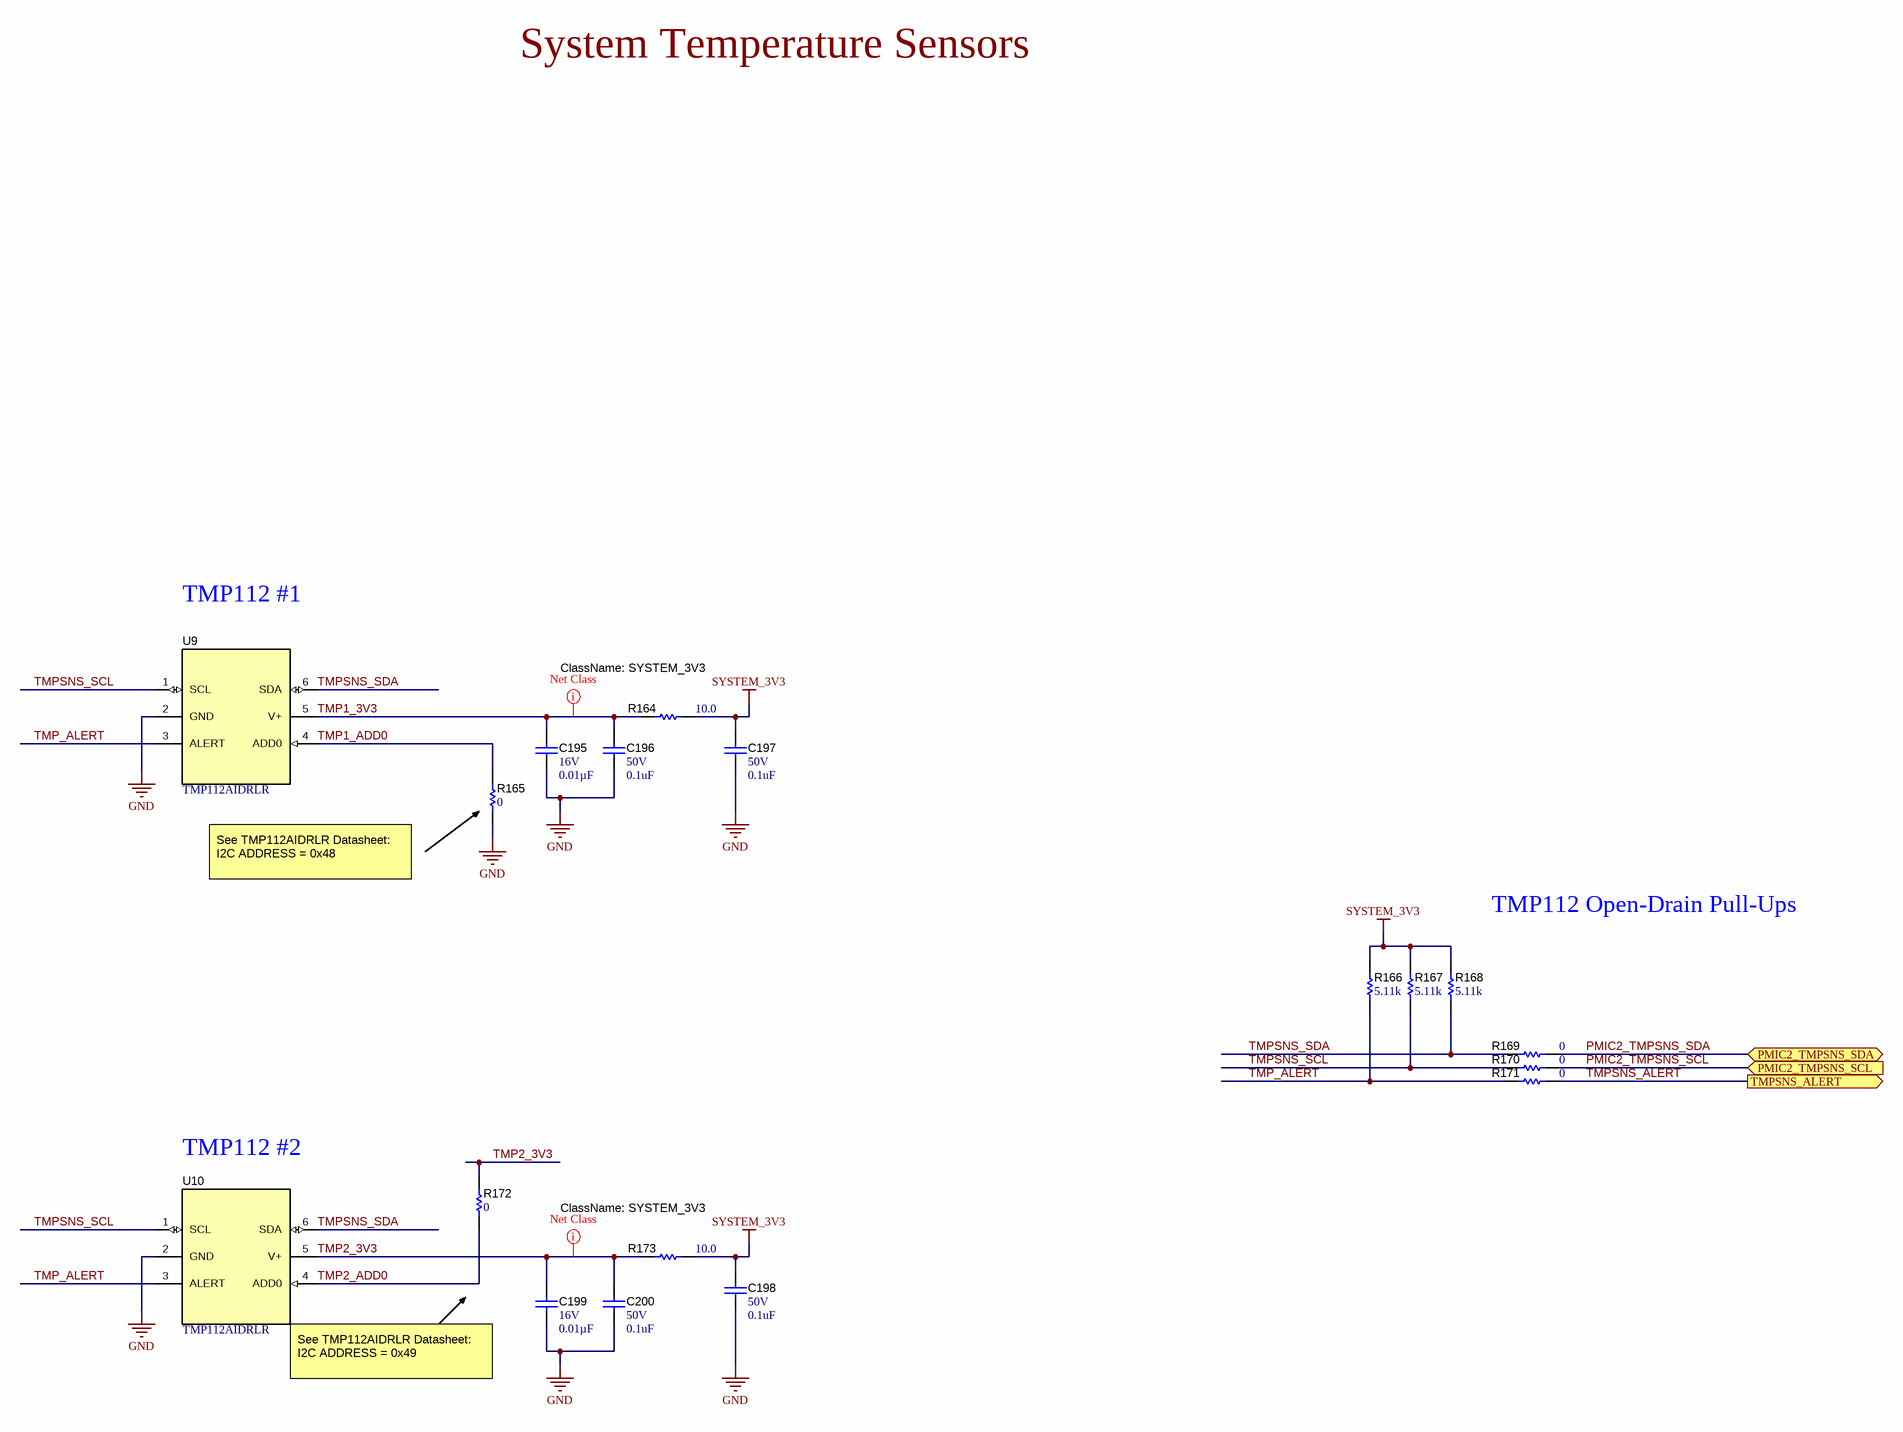
[diagram p12: PROC054D_Temp_Sensor.SchDoc]

### Parts
C195  VDC_V: 16V  ValueDisplayed: 0.01µF  [0402]  (hidden comment: C0402C103K4RACTU)
C196  VDC_V: 50V  ValueDisplayed: 0.1uF  [0402]  (hidden comment: CGA2B3X7R1H104K050BB)
C197  VDC_V: 50V  ValueDisplayed: 0.1uF  [0402]  (hidden comment: CGA2B3X7R1H104K050BB)
C198  VDC_V: 50V  ValueDisplayed: 0.1uF  [0402]  (hidden comment: CGA2B3X7R1H104K050BB)
C199  VDC_V: 16V  ValueDisplayed: 0.01µF  [0402]  (hidden comment: C0402C103K4RACTU)
C200  VDC_V: 50V  ValueDisplayed: 0.1uF  [0402]  (hidden comment: CGA2B3X7R1H104K050BB)
R164  ValueDisplayed: 10.0  [0402]  (hidden comment: CRCW040210R0FKED)
R165  ValueDisplayed: 0  [0402]  (hidden comment: ERJ-2GE0R00X)
R166  ValueDisplayed: 5.11k  [0402]  (hidden comment: CRCW04025K11FKED)
R167  ValueDisplayed: 5.11k  [0402]  (hidden comment: CRCW04025K11FKED)
R168  ValueDisplayed: 5.11k  [0402]  (hidden comment: CRCW04025K11FKED)
R169  ValueDisplayed: 0  [0402]  (hidden comment: ERJ-2GE0R00X)
R170  ValueDisplayed: 0  [0402]  (hidden comment: ERJ-2GE0R00X)
R171  ValueDisplayed: 0  [0402]  (hidden comment: ERJ-2GE0R00X)
R172  ValueDisplayed: 0  [0402]  (hidden comment: ERJ-2GE0R00X)
R173  ValueDisplayed: 10.0  [0402]  (hidden comment: CRCW040210R0FKED)
U9  TMP112AIDRLR  [DRL0006A]
U10  TMP112AIDRLR  [DRL0006A]

### Ports
PMIC2_TMPSNS_SCL (in), PMIC2_TMPSNS_SDA (bidir), TMPSNS_ALERT (out)

### Nets
GND: C195.2 C196.2 C197.2 C198.2 C199.2 C200.2 R165.1 U9.2(GND) U10.2(GND)
SYSTEM_3V3: C197.1 C198.1 R164.1 R166.2 R167.2 R168.2 R173.1
PMIC2_TMPSNS_SCL: R170.2 ; port PMIC2_TMPSNS_SCL
PMIC2_TMPSNS_SDA: R169.2 ; port PMIC2_TMPSNS_SDA
TMP1_3V3: C195.1 C196.1 R164.2 U9.5(V+)
TMP1_ADD0: R165.2 U9.4(ADD0)
TMP2_3V3: C199.1 C200.1 R172.2 R173.2 U10.5(V+)
TMP2_ADD0: R172.1 U10.4(ADD0)
TMP_ALERT: R166.1 R171.1 U9.3(ALERT) U10.3(ALERT)
TMPSNS_ALERT: R171.2 ; port TMPSNS_ALERT
TMPSNS_SCL: R167.1 R170.1 U9.1(SCL) U10.1(SCL)
TMPSNS_SDA: R168.1 R169.1 U9.6(SDA) U10.6(SDA)

### Layout directives
net class SYSTEM_3V3: TMP1_3V3, TMP2_3V3

### Notes on the sheet
- System Temperature Sensors
- TMP112 #1
- See TMP112AIDRLR Datasheet:
  I2C ADDRESS = 0x48
- TMP112 Open-Drain Pull-Ups
- TMP112 #2
- See TMP112AIDRLR Datasheet:
  I2C ADDRESS = 0x49
- Drawn By:
- SVN Rev:
- Number:
- TID #:
- Orderable:
- Rev:
- Sheet Title:
- File:
- Project Title:
- Designed for:
- Assembly VAWRiant:
- Mod. Date:
- Sheet:
- Size:
- of
- C
- http://www.ti.com
- Texas Instruments and/or its licensors do not wAWRrant the accuracy or completeness of this specification or any information contained therein. Texas Instruments and/or its licensors do not wAWRrant that this design will meet the specifications, will be suitable for your application or fit for any pAWRticulAWR purpose, or will operate in an implementation. Texas Instruments and/or its licensors do not wAWRrant that the design is production worthy. You should completely validate and test your design implementation to confirm the system functionality for your application.
- Engineer:
- Contact:
- © Texas Instruments

### Library data of the parts
C195 C199 = CMP-0078218-1: CAP, CERM, 0.01 µF, 16 V,+/- 10%, X7R, 0402; Manufacturer: Kemet; TaMin_C: -55°C; Polarized: N; Green_Lifecycle: Active; SizeAreaWB_mm2: 3; Green_REACh: Passed; U/M: EA; Value: 0.01uF; TaMax_C: 125°C; SizeZ_mm: 0.6; SizeX_mm: 1; SizeY_mm: 0.5; Cap_F: 10nF; AEC Category: Q200; ComponentLink1URL: https://content.kemet.com/datasheets/KEM_C1002_X7R_SMD.pdf; Supplier Part Number 2: 66W8706; Supplier 2: Newark; Supplier Part Number 3: 80-C0402C103K4R; TempCo: X7R; Supplier 3: Mouser; RoHS: Y; MountType: SMT; Green_EU RoHS-2: Passed; Supplier 1: Digi-Key; Green_EU RoHS: Passed; PackageReference: 0402; Tolerance_%: 10%; Cap_Case: 0402; Value2: 16V; SizeArea_mm2: 0.5; CompType: Capacitor; PartNumber: C0402C103K4RACTU; AEC Qualified: N; ComponentLink1Description: Datasheet link; AEC Grade: N/A; Supplier Part Number 1: 399-1038-1-ND; Technology: Ceramic
C196-C198 C200 = CMP-0006325-2: CAP, CERM, 0.1 uF, 50 V, +/- 10%, X7R, AEC-Q200 Grade 1, 0402; Manufacturer: TDK; TaMin_C: -55°C; ESR_ohm: 0.039064; Polarized: N; SizeAreaWB_mm2: 3; Value1: 0.039064 ohm; U/M: EA; Value: 0.1uF; TaMax_C: 125°C; SizeZ_mm: 0.6; SizeX_mm: 1; SizeY_mm: 0.5; AEC Qualified: Y; Cap_F: 100nF; IRMS_A: 8.14669dA; AEC Category: Q200; Supplier Part Number 2: 04X3148; Publisher: Texas Instruments; Supplier 2: Newark; Supplier Part Number 3: 810-CGA2B3X7R1H104K; TempCo: X7R; Supplier 3: Mouser; Published: 2008-06-19; RoHS: Y; MountType: SMT; Supplier 1: Digi-Key; PackageReference: 0402; Tolerance_%: 10%; Cap_Case: 0402; Value2: 50V; SizeArea_mm2: 0.5; CompType: Capacitor; LatestRevisionDate: 2017-03-09; PartNumber: CGA2B3X7R1H104K050BB; ComponentLink1Description: Datasheet link; AEC Grade: 1; Supplier Part Number 1: 445-6899-1-ND; Technology: Ceramic; ComponentLink1URL: https://product.tdk.com/en/search/capacitor/ceramic/mlcc/info?part_no=CGA2B3X7R1H104K050BB
R164 R173 = CMP-0025963-3: RES, 10.0, 1%, 0.063 W, AEC-Q200 Grade 0, 0402; Manufacturer: Vishay-Dale; Power_W: 63mW; TempCo: 100 ppm/C; Value_Code: 10R0; Value: 10.0; EIA_Code: E96; Res_ohm: 10; SizeX_mm: 1; SizeY_mm: 0.5; SizeZ_mm: 0.6; Value2: 0.063W; AEC Qualified: Y; VDC_V: 50V; AEC Category: Q200; AEC Grade: 0; Supplier Part Number 2: 52K6600; Supplier 2: Newark; Supplier Part Number 3: 71-CRCW0402-10-E3; Supplier 3: Mouser; RoHS: E; Value1: 1%; MountType: SMT; Supplier 1: Digi-Key; PackageReference: 0402; Tolerance_%: 1%; SizeArea_mm2: 0.5; CompType: Resistor; PartNumber: CRCW040210R0FKED; ComponentLink1Description: Datasheet link; Supplier Part Number 1: 541-10.0LCT-ND; Technology: Thick Film; ComponentLink1URL: http://www.vishay.com/docs/20035/dcrcwe3.pdf
R165 R172 = CMP-0026992-3: as R142 on sheet PROC054D_FMCW_Sync; Supplier Part Number 2: 65T8307; Supplier 2: Newark; Supplier Part Number 3: 667-ERJ-2GE0R00X; Supplier 3: Mouser; RoHS: Y; Value1: 5%; MountType: SMT; Supplier 1: Digi-Key; PackageReference: 0402; Tolerance_%: 5%; Res_ohm: 0; SizeArea_mm2: 0.5; PartNumber: ERJ-2GE0R00X; ComponentLink1Description: Datasheet link; Supplier Part Number 1: P0.0JCT-ND; Technology: Thick Film; ComponentLink1URL: https://industrial.panasonic.com/cdbs/www-data/pdf/RDA0000/AOA0000C301.pdf; AEC Grade: 0
R166-R168 = CMP-0026463-2: RES, 5.11 k, 1%, 0.063 W, AEC-Q200 Grade 0, 0402; Manufacturer: Vishay-Dale; Power_W: 63mW; TempCo: 100 ppm/C; Value_Code: 5k11; Value: 5.11k; EIA_Code: E96; SizeX_mm: 1; SizeY_mm: 0.5; SizeZ_mm: 0.6; Value2: 0.063W; CompType: Resistor; AEC Qualified: Y; VDC_V: 50V; AEC Category: Q200; AEC Grade: 0; ComponentLink1URL: http://www.vishay.com/docs/20035/dcrcwe3.pdf; Supplier Part Number 2: 52K7119; Supplier 2: Newark; Supplier Part Number 3: 71-CRCW0402-5.11K-E3; Supplier 3: Mouser; RoHS: E; Value1: 1%; MountType: SMT; Supplier 1: Digi-Key; PackageReference: 0402; Tolerance_%: 1%; Res_ohm: 5.11k; SizeArea_mm2: 0.5; PartNumber: CRCW04025K11FKED; ComponentLink1Description: Datasheet link; Supplier Part Number 1: 541-5.11KLCT-ND; Technology: Thick Film
R169-R171 = CMP-0026992-3: as R143 on sheet PROC054D_FMCW_Sync; Supplier Part Number 2: 65T8307; Supplier 2: Newark; Supplier Part Number 3: 667-ERJ-2GE0R00X; Supplier 3: Mouser; RoHS: Y; Value1: 5%; MountType: SMT; Supplier 1: Digi-Key; PackageReference: 0402; Tolerance_%: 5%; Res_ohm: 0; SizeArea_mm2: 0.5; CompType: Resistor; PartNumber: ERJ-2GE0R00X; ComponentLink1Description: Datasheet link; Supplier Part Number 1: P0.0JCT-ND; Technology: Thick Film; ComponentLink1URL: https://industrial.panasonic.com/cdbs/www-data/pdf/RDA0000/AOA0000C301.pdf; AEC Grade: 0
U9 U10 = CMP-0067397-2: 1.4V-Capable +/-0.5degC Temperature Sensor with Alert Function and I2C/SMBus interface in SOT-563, DRL0006A (SOT-OTHER-6); Alternate PartNumber: TMP112AIDRLT; Alternate Manufacturer: Texas Instruments; Green_Lifecycle: Active; SizeAreaWB_mm2: 6.76; Green_REACh: Passed; U/M: EA; SizeZ_mm: 0.6; SizeX_mm: 1.6; SizeArea_mm2: 2.56; CompType: IC; ComponentLink1URL: http://www.ti.com/lit/ds/symlink/tmp112.pdf; Publisher: Texas Instruments; PackageDescription: SOT-OTHER-6; RoHS: Y; MountType: SMT; Green_EU RoHS-2: Passed; Manufacturer: Texas Instruments; Green_EU RoHS: Passed; PackageReference: DRL0006A; SizeY_mm: 1.6; LatestRevisionDate: 2017-06-09; PartNumber: TMP112AIDRLR; ComponentLink1Description: Datasheet Link